# EAGLE design LM3409HV (EAGLE 6.1)
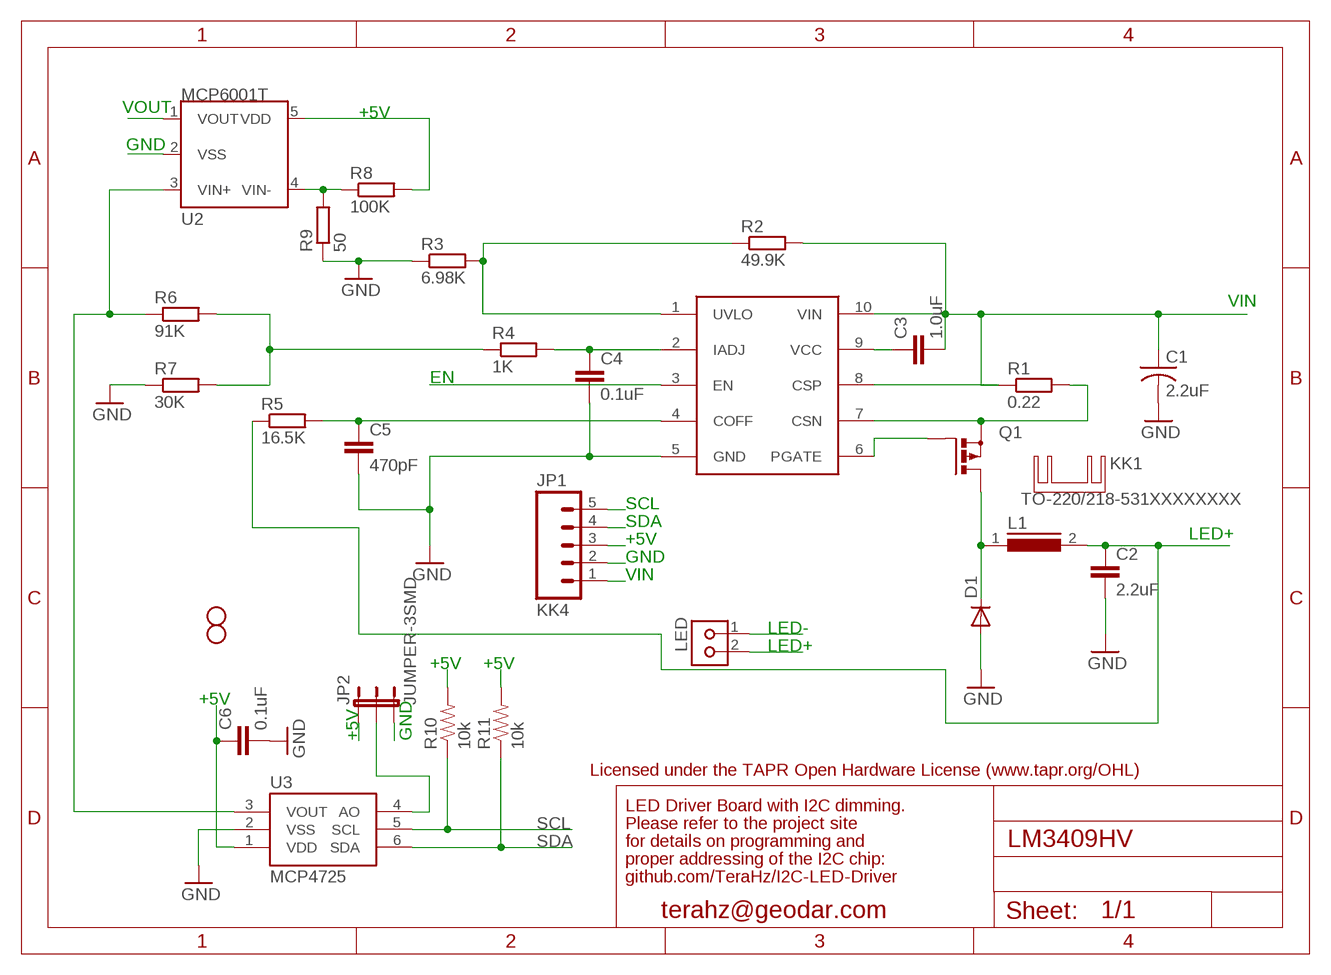
[diagram p0: schematic, sheet 1]

## Parts
C1  2.2uF  C-USC1210  [C1210]
C2  2.2uF  C-EUC1210  [C1210]
C3  1.0uF  CAP0603-CAP  [0603-CAP]
C4  0.1uF  CAP0603-CAP  [0603-CAP]
C5  470pF  CAP0603-CAP  [0603-CAP]
C6  0.1uF  CAP0603-CAP  [0603-CAP]
D1  DIODE-SMC  [SMC]
JP1  KK4  M05PTH  [1X05]
JP2  JUMPER-3SMD  [SJ_3]
JP5  STAND-OFF  [STAND-OFF]
JP6  STAND-OFF  [STAND-OFF]
KK1  TO-220/218-531XXXXXXXX  [531XXXXXXXX]
L1  DR125  [DR125]
LED  KK2VRND  [KK-V-2-RND]
Q1  PMOSFET_PTO220BV  [TO220BV]
R1  0.22  R-EU_R2512  [R2512]
R2  49.9K  R-EU_R0603  [R0603]
R3  6.98K  R-EU_R0603  [R0603]
R4  1K  R-EU_R0603  [R0603]
R5  16.5K  R-EU_R0603  [R0603]
R6  91K  R-EU_R0603  [R0603]
R7  30K  R-EU_R0603  [R0603]
R8  100K  R-EU_R0603  [R0603]
R9  50  R-EU_R0603  [R0603]
R10  10k  RESISTOR0603  [0603]
R11  10k  RESISTOR0603  [0603]
U1  LM3409  [MSOP-10-GNDPAD]
U2  MCP6001T  MCP6XXX  [SOT23-5]
U3  MCP4725  DAC_MCP4725SOT  [SOT23-6]

## Nets
+5V: C6.1 JP1.3 JP2.1 R8.2 R10.2 R11.2 U2.5(VDD) U3.1(VDD)
ANALOG: R6.1 U2.3(VIN+) U3.3(VOUT)
EN: U1.3(EN) U2.1(VOUT)
GND: C1.2 C2.2 C4.2 C5.2 C6.2 D1.A JP1.2 JP2.3 LED.1 R3.1 R7.1 R9.1 U1.5(GND) U2.2(VSS) U3.2(VSS)
IADJ2: C4.1 R4.2 U1.2(IADJ)
LED+: C2.1 L1.2 LED.2 R5.1
N$1: JP2.2 U3.4(AO)
N$2: Q1.S R1.2 U1.7(CSN)
N$3: C5.1 R5.2 U1.4(COFF)
N$5: C3.1 U1.9(VCC)
N$6: D1.C L1.1 Q1.D
N$7: Q1.G U1.6(PGATE)
N$8: R8.1 R9.2 U2.4(VIN-)
SCL: JP1.5 R10.1 U3.5(SCL)
SDA: JP1.4 R11.1 U3.6(SDA)
UVLO: R2.1 R3.2 U1.1(UVLO)
VADJ: R4.1 R6.2 R7.2
VIN: C1.1 C3.2 JP1.1 R1.1 R2.2 U1.8(CSP) U1.10(VIN)

## Notes on the sheet
- VOUT
- +5V
- GND
- VIN
- EN
- SCL
- SDA
- LED+
- +5V
- GND
- VIN
- LED-
- LED+
- +5V | +5V
- +5V
- +5V | GND
- Licensed under the TAPR Open Hardware License (www.tapr.org/OHL)
- LED Driver Board with I2C dimming.
- Please refer to the project site
- for details on programming and
- proper addressing of the I2C chip:
- github.com/TeraHz/I2C-LED-Driver
- terahz@geodar.com

## Library data of the parts
C1 = resistor:C-US: CAPACITOR, American symbol
C2 = resistor:C-EU: CAPACITOR, European symbol
C3-C6 = SparkFun:CAP: Capacitor Standard 0603 ceramic capacitor, and 0.1" leaded capacitor.
D1 = diode:DIODE-: DIODE
JP1 = SparkFun:M05: Header 5 Standard 5-pin 0.1" header. Use with straight break away headers (SKU : PRT-00116), right angle break away headers (PRT-00553), swiss pins (PRT-00743), machine pins (PRT-00117), and female headers (PRT-00115). Molex polarized connector foot print use with SKU : PRT-08230 with associated crimp pins and housings.
JP2 = SparkFun:JUMPER-3
JP5 JP6 = SparkFun:STAND-OFF: Stand Off This is the mechanical footprint for a #4 phillips button head screw. Use the keepout ring to avoid running the screw head into surrounding components. SKU : PRT-00447
KK1 = Unknown:TO-220/218: HEATSINKS TO-220/218
L1 = inductors:DR125: High Power Density, High Efficiency, Shielded Inductors Source: coiltronics_dr_series.pdf
LED = molex-kk:KK2*: Molex KK 2-pin connector, 100 mil pin spacing
Q1 = transistor-power:PMOSFET_P: Power MOSFET P-Channel
R1-R9 = resistor:R-EU_: RESISTOR, European symbol
R10 R11 = SparkFun:RESISTOR: Resistor Basic schematic elements and footprints for 0603, 1206, and PTH 1/10th watt (small) resistors.
U1 = terahz:LM3409
U2 = terahz:MCP6XXX: Microchip MCP6XXX series SOT23-5 opamps MCP6001/2/4 <http://ww1.microchip.com/downloads/en/DeviceDoc/21733e.pdf> - 1 MHz, Low-Power Op Amp MCP6241/2 <http://ww1.microchip.com/downloads/en/DeviceDoc/21882b.pdf> - 50 ?A, 650 kHz Rail-to-Rail Op Amp
U3 = SparkFun:DAC_MCP4725

## Board
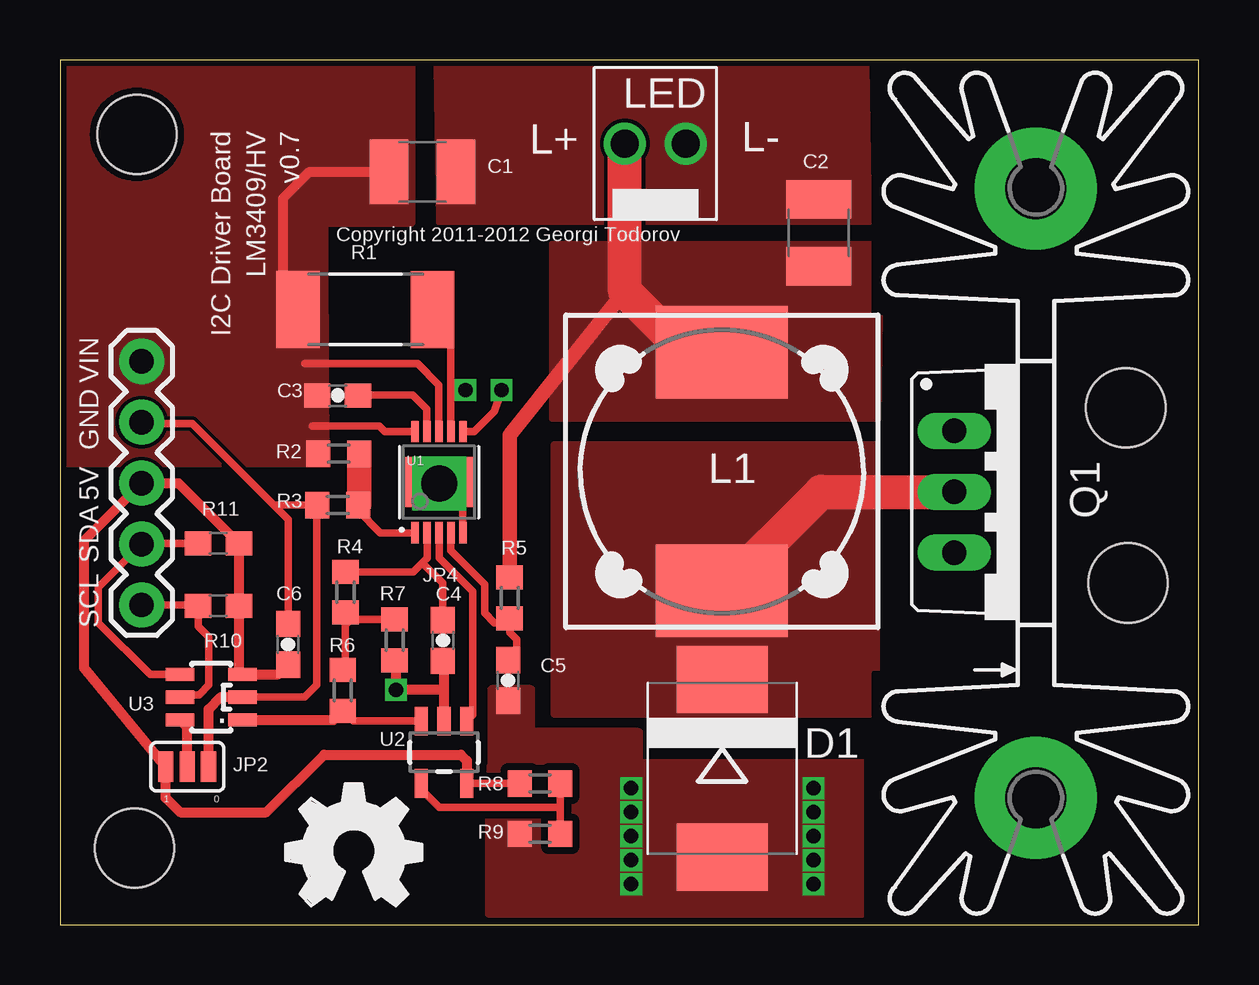
[diagram p1: board, top side]
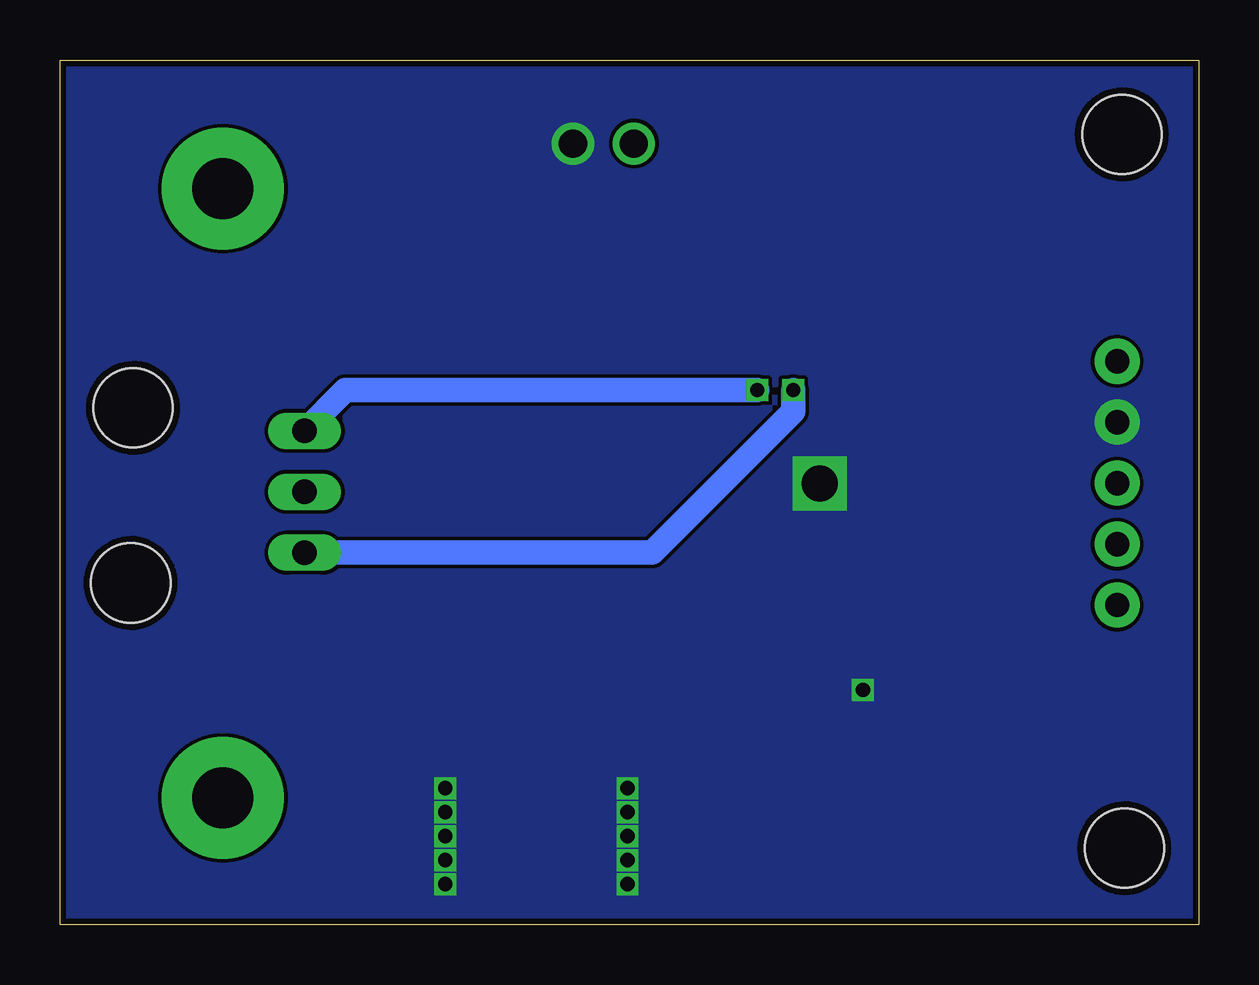
[diagram p2: board, bottom side, seen from below]

Size 47.45 x 36.06 mm. Coordinates in mm from the lower left corner, seen from the top.
Outline: 0,0 47.45,0 47.45,36.06 0,36.06 0,0
Copper layers (1*16): Top 0.035mm / dielectric 1.5mm / Bottom 0.035mm
Design rules "Fusion_eagle_rule_v1.1": minimum track width 6mil, minimum drill 12mil, track to track 6mil, track to pad 6mil, pad to pad 6mil, via to via 6mil, smd to smd 0mil, copper to edge 10mil, drill to drill 10mil, minimum pad ring 10mil, minimum via ring 6mil, stop-mask expansion 2mil, vias tented up to drill 100mil, thermal gap 10mil

### Footprints (pad centres in the part's own frame; a part is rotated, then mirrored left to right if it is on the bottom)
C1210 = smd 1.6 x 2.7: 1 -1.4,0; 2 1.4,0
0603-CAP = smd 1.1 x 1: 1 -0.85,0; 2 0.85,0
SMC = smd 2.8 x 3.8: A 3.7,0; C -3.7,0
1X05 = drill 1.016 pad 1.88 round: 1 0,0; 2 2.54,0; 3 5.08,0; 4 7.62,0; 5 10.16,0
SJ_3 = smd 0.635 x 1.27: 1 -0.889,0; 2 0,0; 3 0.889,0
STAND-OFF = hole 3.302: 0,0
531XXXXXXXX = drill 2.54 pad 5.08 round: A2,5 -12.7,-0.762; B2,5 12.7,-0.762
DR125 = smd 3.85 x 5.5: 1 -4.975,0; 2 4.975,0
KK-V-2-RND = drill 1.168 round: 1 0,1.27; 2 0,-1.27
TO220BV = drill 1.016 long: D 0,-2.54; G -2.54,-2.54; S 2.54,-2.54
R2512 = smd 1.8 x 3.2: 1 -2.8,0; 2 2.8,0
R0603 = smd 1 x 1.1: 1 -0.85,0; 2 0.85,0
0603 = smd 1.1 x 1: 1 -0.85,0; 2 0.85,0
MSOP-10-GNDPAD = smd 0.305 x 0.889: 1 -1,-2.11; 2 -0.5,-2.11; 3 0,-2.11; 4 0.5,-2.11; 5 1,-2.11; 6 1,2.11; 7 0.5,2.11; 8 0,2.11; 9 -0.5,2.11; 10 -1,2.11 | smd 2.794 x 2.083: GND 0,0
SOT23-5 = smd 0.55 x 1.2: 1 -0.95,-1.3; 2 0,-1.3; 3 0.95,-1.3; 4 0.95,1.3; 5 -0.95,1.3
SOT23-6 = smd 0.55 x 1.2: 1 0.95,-1.3; 2 0,-1.3; 3 -0.95,-1.3; 4 -0.95,1.3; 5 0,1.3; 6 0.95,1.3

### Placement (x,y rotation side)
C1  15.11,31.39 0 top
C2  31.62,28.85 90 top
C3  11.57,22.07 180 top
C4  15.95,11.86 270 top
C5  18.67,10.2 270 top
C6  9.5,11.7 90 top
D1  27.59,6.53 270 top
JP1  3.4,23.5 270 top
JP2  5.3,6.6 0 top
JP4  STAND-OFF  [STAND-OFF]  44.4,21.56 0 top
JP5  3.1,3.2 0 top
JP6  44.5,14.26 0 top
JP7  STAND-OFF  [STAND-OFF]  3.2,32.96 0 top
KK1  39.9,18 90 top
L1  27.58,18.9 90 top
LED  24.81,32.58 270 top
Q1  39.8,18.06 270 top
R1  12.72,25.66 0 top
R2  11.62,19.65 180 top
R3  11.58,17.5 0 top
R4  11.9,13.87 90 top
R5  18.73,13.63 270 top
R6  11.78,9.78 90 top
R7  13.94,11.88 90 top
R8  20,5.9 180 top
R9  20,3.8 0 top
R10  6.6,13.3 0 top
R11  6.6,15.9 0 top
U1  15.79,18.46 0 top
U2  16,7.2 180 top
U3  6.3,9.5 90 top
U$1  [OSHW_FILLX200_NOTEXT]  9.4,0.8 0 top

### Tracks (layer width: path | path; a pad name or v marks a point on that pad's centre or on a via)
+5V
  Top 0.305: U2.5 R8.2 | R8.2
  Top 0.406: C6.1 9.1,10.45 U3.1 7.45,10.6 R10.2 R11.2 4.93,18.42 JP1.3 1,16.02 1,10.71 JP2.1 4.4,6.89 4.4,5.3 5,4.7 8.6,4.7 11,7.1 16.7,7.1 16.95,6.85 U2.5
ANALOG
  Top 0.305: U2.3 12.22,8.5 R6.1 | U3.3 7.95,8.55
  Top 0.406: R6.1 11.4,8.55 U3.3
EN
  Top 0.305: U1.3 15.8,15.3 17.2,13.9 17.2,8.75 U2.1
GND  (via drill 0.6, 1.5)
  Top 0.305: U1.5 16.79,17.41 v15.8,18.4 | 8.9,17.5 R3.1 10.7,17.47 10.7,10 10.2,9.5 U3.2 | 8.9,17.5 5.5,20.9 3.46,20.9 JP1.2 | C6.2 9.5,16.9 8.9,17.5 | R7.1 13.94,10.76
  Top 0.406: JP2.3 6.19,8.99 6.7,9.5 U3.2 | U2.2 16,9.8 | 16,9.8 16,10.96 | 16,10.96 C4.2 16,11.01 16,10.96 | R7.1 14,10.97 v14,9.8 16,9.8
  other vias: 23.8,5.7 23.8,4.7 23.8,3.7 23.8,2.7 23.8,1.7 31.4,1.7 31.4,2.7 31.4,3.7 31.4,4.7 31.4,5.7
  pour Bottom (no thermals): 0.11,37.64 47.62,37.64 47.52,-0.11 -0.09,0.08
  pour Top (no thermals): 15.7,35.9 33.6,35.9 33.7,29.3 15.8,29.3
  pour Top (isolate 0.305, no thermals): 33.6,6.7 24.1,6.7 24.1,8 19.6,8 19.6,9.8 18,9.8 18,6.4 17.9,6.5 17.9,0.5 33.6,0.4
IADJ2
  Top 0.305: U1.2 15.3,15.3 15.1,15.1 | R4.2 14.72,14.72 15.1,15.1 | C4.1 15.95,14.25 15.1,15.1
LED+
  Top 0.61: L1.2 27.5,23.1 | R5.1 18.73,20.42 23.54,26.43
  Top 0.813: L1.2 28.96,23.1 26.86,23.1
  Top 1.016: 26.86,23.1 26.9,23.06
  Top 1.422: LED.2 23.54,26.43 26.86,23.1
  pour Top (no thermals): 20.5,28.4 34.2,28.4 34.1,21.1 20.5,21.1
N$1
  Top 0.406: U3.4 5.3,8.25 JP2.2
N$2  (via drill 0.6)
  Top 0.305: U1.7 16.29,22.2 | 16.29,22.2 16.29,24.89 R1.2 | v16.9,22.3 16.39,22.3 16.29,22.2
  Bottom 1.016: v16.9,22.3 16.9,21.4 22.78,15.52 Q1.S
N$3
  Top 0.305: 18.72,11 C5.1 19.03,11.31 19.03,11.9 18.73,12.2 R5.2 18.55,12.6 18.1,12.6 17.7,13 17.7,14.2 16.29,15.61 U1.4
N$5
  Top 0.305: U1.9 15.29,21.51 14.7,22.1 12.64,22.1 C3.1
N$6
  Top 1.422: Q1.D 31.71,18.06 L1.1
  pour Top (no thermals): 20.6,20 34,20 34,8.8 20.6,8.8
N$7  (via drill 0.6)
  Top 0.305: U1.6 17.27,20.57 18.1,21.4 v18.4,22.3
  Bottom 1.016: v18.4,22.3 35.56,22.3 Q1.G
N$8
  Top 0.305: 20.85,4.9 R9.2 | 20.85,4.9 R8.1 | U2.4 15.05,5.65 15.8,4.9 20.85,4.9
SCL
  Top 0.305: JP1.5 5.71,13.34 R10.1 5.75,12.45 6.2,12 6.2,10 5.8,9.6 5.1,9.6 U3.5
SDA
  Top 0.305: R11.1 3.42,15.9 JP1.4 1.6,14.08 1.6,12.6 3.75,10.45 U3.6
UVLO
  Top 0.305: U1.1 13.35,16.35 12.43,17.27 R3.2
  Top 1.016: R2.1 12.46,17.54 R3.2
VADJ
  Top 0.305: 11.89,12.5 11.89,10.74 R6.2 | 11.89,12.5 R4.1 | R7.2 12.12,12.73 11.89,12.5
VIN
  Top 0.305: U1.8 15.79,22.51 14.9,23.4 10.2,23.4 | U1.10 13.53,20.57 13.3,20.8 10.5,20.8
  Top 0.406: C1.1 10.39,31.39 9.3,30.3 9.3,26.28 R1.1
  pour Top (no thermals): -0.1,35.9 11,35.9 11.1,19.2 0,19.2
  pour Top (no thermals): 11.1,35.9 14.6,35.9 14.6,29.3 11.1,29.3

### Text on the board
tPlace: L- | I2C Driver Board | LM3409/HV | v0.7 | L+ | Copyright 2011-2012 Georgi Todorov | VIN | GND | 5V | SDA | SCL | . | 1 | 0
tNames: JP4 | JP2